# EAGLE design RocketometerPx 9DS0 (EAGLE 6.2)
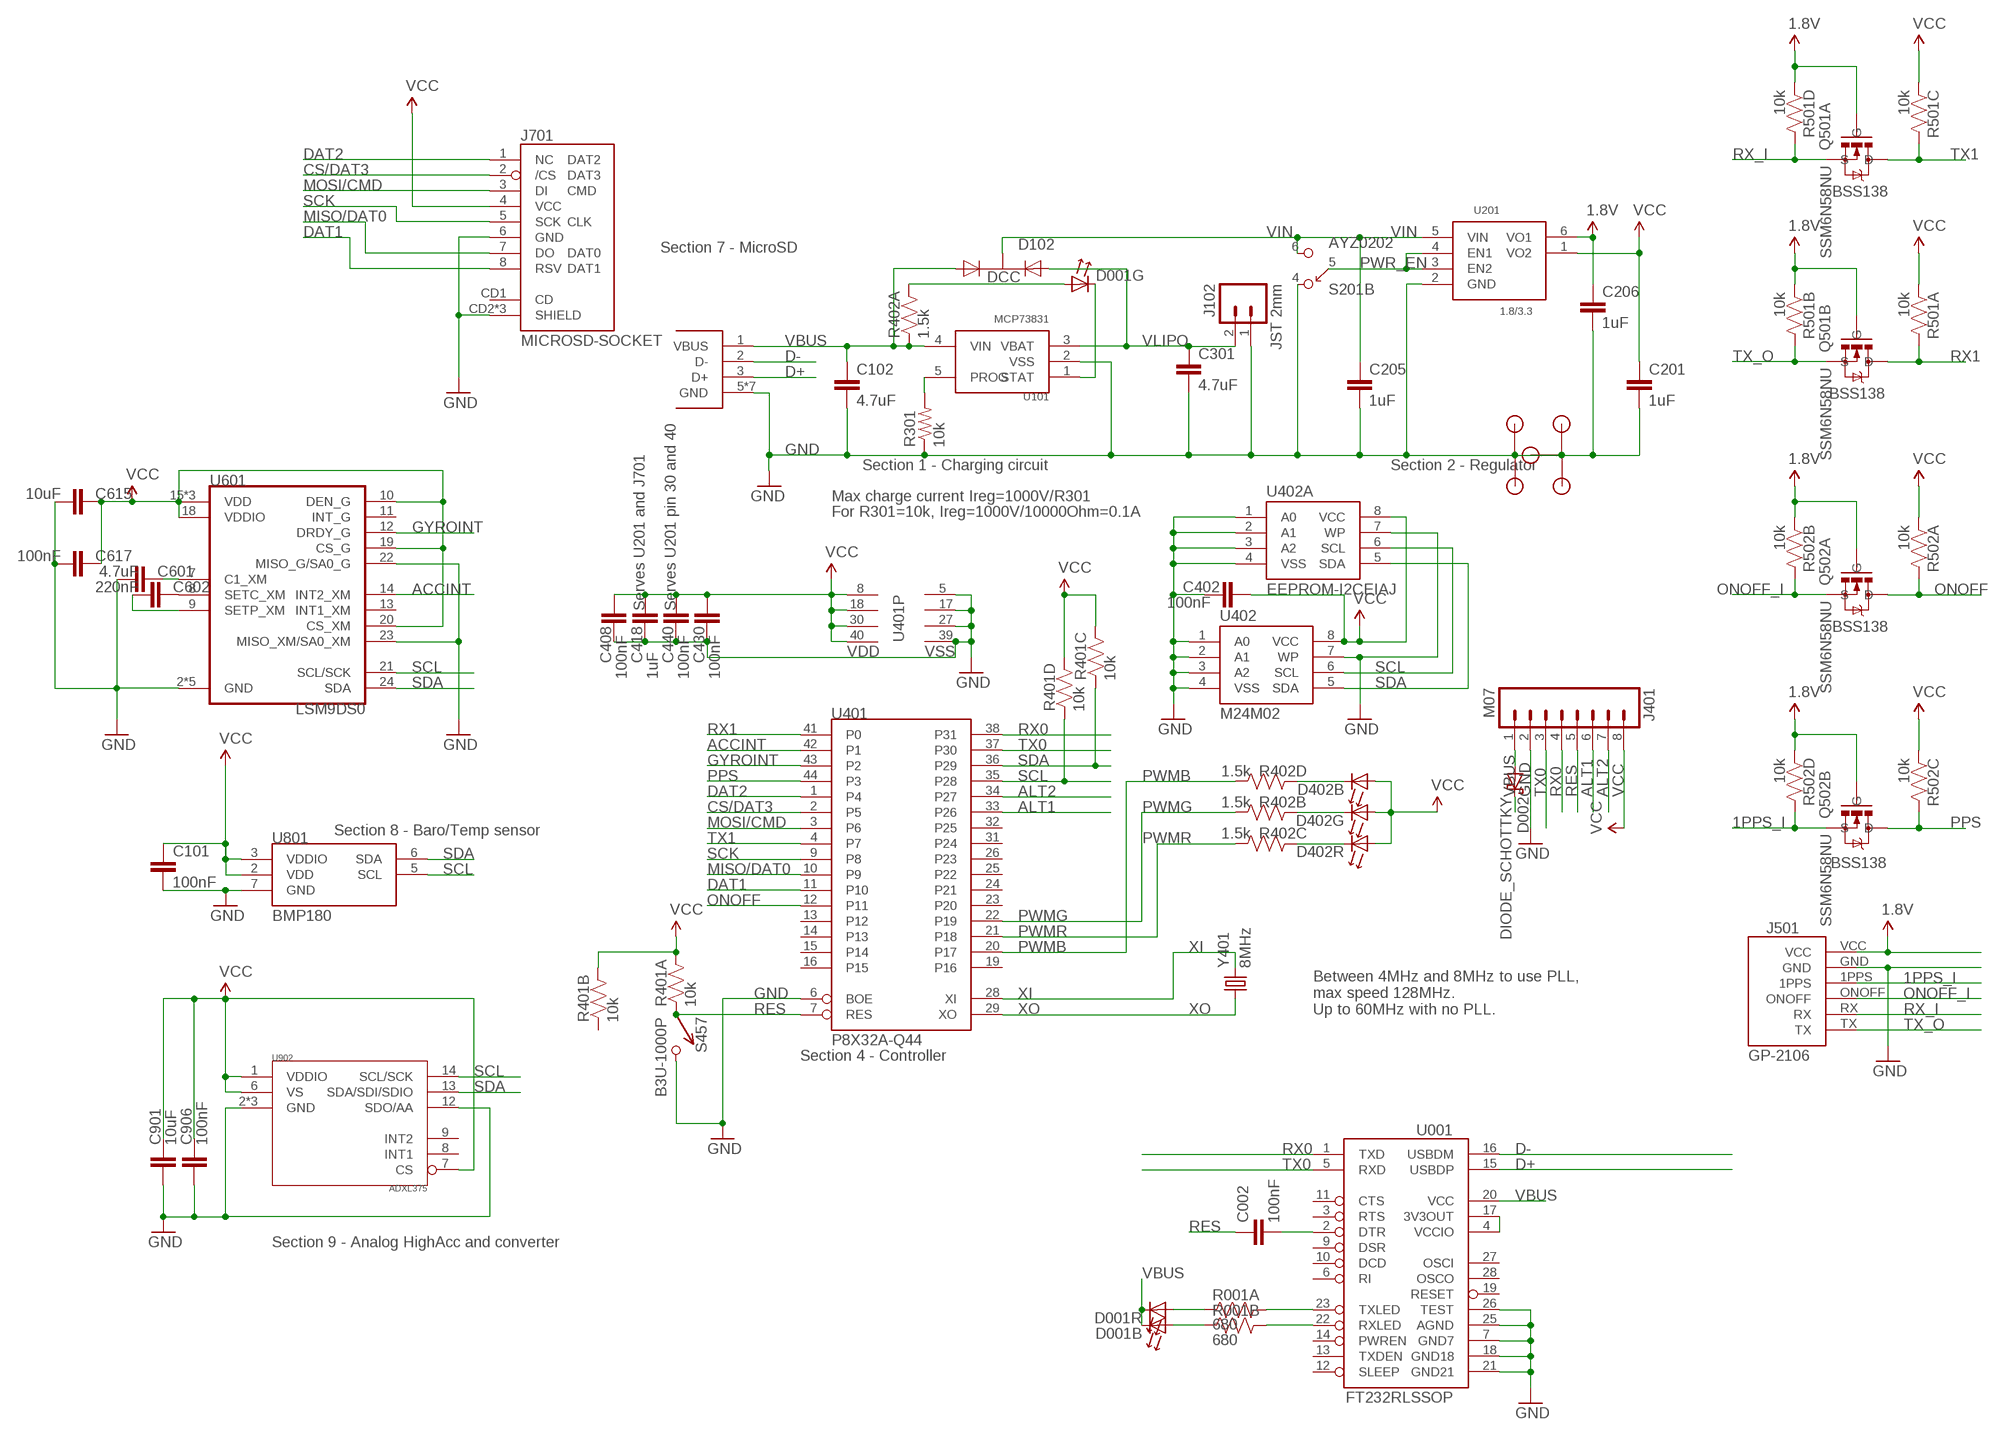
[diagram p0: schematic, sheet 1]

## Parts
C002  100nF  CAP0402-CAP  [0402-CAP]
C101  100nF  CAP0402-CAP  [0402-CAP]
C102  4.7uF  CAP0402-CAP  [0402-CAP]
C201  1uF  CAP0402-CAP  [0402-CAP]
C205  1uF  CAP0402-CAP  [0402-CAP]
C206  1uF  CAP0402-CAP  [0402-CAP]
C301  4.7uF  CAP0402-CAP  [0402-CAP]
C402  100nF  CAP0402-CAP  [0402-CAP]
C408  100nF  CAP0402-CAP  [0402-CAP]
C418  1uF  CAP0402-CAP  [0402-CAP]
C430  100nF  CAP0402-CAP  [0402-CAP]
C440  100nF  CAP0402-CAP  [0402-CAP]
C601  4.7uF  CAP0402-CAP  [0402-CAP]
C602  220nF  CAP0402-CAP  [0402-CAP]
C615  10uF  CAP0603-CAP  [0603-CAP]
C617  100nF  CAP0402-CAP  [0402-CAP]
C901  10uF  CAP0603-CAP  [0603-CAP]
C906  100nF  CAP0402-CAP  [0402-CAP]
D001  SMLP36RGB2W(R)  [SMLP36]
D002  DIODE_SCHOTTKY  [D0603]
D102  DCC  PMEG2005CT  [SOT-23-3]
D402  SMLP36RGB2W(R)  [SMLP36]
J001  USB_MICROB_JSTFCI  [USB-MICROB-CONN-09505]
J102  JST 2mm  M02-JST-2MM-SMT  [JST-2-SMD]
J401  M07  M08NOSILK  [M08SIP]
J501  GP-2106  [GP-2106]
J701  MICROSD-SOCKET  [MICROSD-SOCKET-PP]
JP1  STANDOFF  [STANDOFF]
JP2  STANDOFF  [STANDOFF]
JP3  STANDOFF  [STANDOFF]
JP4  STANDOFF  [STANDOFF]
JP5  STANDOFF  [STANDOFF]
Q501  SSM6N58NU  [UDFN6]
Q502  SSM6N58NU  [UDFN6]
R001  680  RP2EXB24V  [CRA02]
R301  10k  RESISTOR0402-RES  [0402-RES]
R401  10k  RP404  [CRA04]
R402  1.5k  RP404  [CRA04]
R501  10k  RP404  [CRA04]
R502  10k  RP404  [CRA04]
S201  AYZ0202  [AYZ0202]
S457  B3U-1000P  [B3U-1000P]
U001  FT232RLSSOP  [SSOP28DB]
U101  MCP73831  [SOT-23-5]
U201  1.8/3.3  AP73X2  [SOT-23-6]
U401  P8X32A-Q44  [P8X32A-Q44]
U402  M24M02  EEPROM-I2C  [SO8N]
U402A  EEPROM-I2CEIAJ  [SO08-EIAJ]
U601  LSM9DS0  [LGA24_LSM]
U801  BMP180  [BMP180]
U902  ADXL375  [ADXL375]
Y401  8MHz  NX3225GD  [CRYSTAL_SMD_3_2MM_2_5MM]

## Nets
1.8V: C206.1 J501.VCC Q501.2(A:G) Q501.5(B:G) Q502.2(A:G) Q502.5(B:G) R501.2 R501.4 R502.2 R502.4 U201.6(VO1)
1PPS_I: J501.1PPS Q502.4(B:S) R502.5
ACCINT: U401.42(P1) U601.14(INT2_XM)
ALT1: J401.6 U401.33(P26)
ALT2: J401.7 U401.34(P27)
CS/DAT3: J701.2(/CS) U401.2(P5)
D+: J001.3(D+) U001.15(USBDP)
D-: J001.2(D-) U001.16(USBDM)
DAT1: J701.8(RSV) U401.11(P10)
DAT2: J701.1(NC) U401.1(P4)
DTR#: C002.2 U001.2(DTR)
GND [power]: C101.2 C102.2 C201.2 C205.2 C206.2 C301.2 C402.2 C408.2 C418.2 C430.2 C440.2 C601.2 C615.1 C617.1 C901.2 C906.2 J001.5(GND) J001.P1(GND) J001.P2(GND) J001.P3(GND) J001.P4(GND) J001.P5(GND) J001.P6(GND) J102.1 J401.2 J501.GND J701.6(GND) J701.CD2(SHIELD) J701.GND1(SHIELD) J701.GND3(SHIELD) JP1.P$1 JP2.P$1 JP3.P$1 JP4.P$1 JP5.P$1 R301.1 S201.4 S457.P$2 U001.7(GND7) U001.18(GND18) U001.21(GND21) U001.25(AGND) U001.26(TEST) U101.2(VSS) U201.2(GND) U401.5(VSS) U401.6(BOE) U401.17(VSS) U401.27(VSS) U401.39(VSS) U402.1(A0) U402.2(A1) U402.3(A2) U402.4(VSS) U402.7(WP) U402A.1(A0) U402A.2(A1) U402A.3(A2) U402A.4(VSS) U402A.7(WP) U601.2(GND) U601.3(GND) U601.4(GND) U601.5(GND) U601.6(GND) U601.22(MISO_G/SA0_G) U601.23(MISO_XM/SA0_XM) U801.7(GND) U902.2(GND) U902.4(GND) U902.5(GND) U902.12(SDO/AA)
GYROINT: U401.43(P2) U601.12(DRDY_G)
MISO/DAT0: J701.7(DO) U401.10(P9)
MOSI/CMD: J701.3(DI) U401.3(P6)
N$1: U001.4(VCCIO) U001.17(3V3OUT)
N$2: R301.2 U101.5(PROG)
N$3: C601.1 U601.7(C1_XM)
N$4: D001.5(G:C) U101.1(STAT)
N$5: D001.6(G:A) R402.8
N$6: C602.1 U601.8(SETC_XM)
N$7: C602.2 U601.9(SETP_XM)
N$9: D001.4(R:A) R001.1
N$11: D001.2(B:A) R001.2
ONOFF: Q502.6(A:D) R502.8 U401.12(P11)
ONOFF_I: J501.ONOFF Q502.1(A:S) R502.7
PPS: Q502.3(B:D) R502.6 U401.44(P3)
PWMB: R402.4 U401.20(P17)
PWMG: R402.2 U401.22(P19)
PWMR: R402.3 U401.21(P18)
PWR_EN: S201.5 U201.3(EN2) U201.4(EN1)
QWMB: D402.3(R:C) R402.6
QWMG: D402.5(G:C) R402.7
QWMR: D402.1(B:C) R402.5
RES: C002.1 J401.5 R401.1 S457.P$1 U401.7(RES)
RX0: J401.4 U001.1(TXD) U401.38(P31)
RX1: Q501.3(B:D) R501.8 U401.41(P0)
RX_I: J501.RX Q501.1(A:S) R501.5
RXLED1: R001.3 U001.22(RXLED)
SCK: J701.5(SCK) U401.9(P8)
SCL: R401.4 U401.35(P28) U402.6(SCL) U402A.6(SCL) U601.21(SCL/SCK) U801.5(SCL) U902.14(SCL/SCK)
SDA: R401.3 U401.36(P29) U402.5(SDA) U402A.5(SDA) U601.24(SDA) U801.6(SDA) U902.13(SDA/SDI/SDIO)
TX0: J401.3 U001.5(RXD) U401.37(P30)
TX1: Q501.6(A:D) R501.6 U401.4(P7)
TX_O: J501.TX Q501.4(B:S) R501.7
TXLED1: R001.4 U001.23(TXLED)
VBUS: C102.1 D001.1(B:C) D001.3(R:C) D002.C(K) D102.1(A1) J001.1(VBUS) R402.1 U001.20(VCC) U101.4(VIN)
VBUS+: D002.A J401.1
VCC [power]: C101.1 C201.1 C402.1 C408.1 C418.1 C430.1 C440.1 C615.2 C617.2 C901.1 C906.1 D402.2(B:A) D402.4(R:A) D402.6(G:A) J401.8 J701.4(VCC) R401.5 R401.6 R401.7 R401.8 R501.1 R501.3 R502.1 R502.3 U201.1(VO2) U401.8(VDD) U401.18(VDD) U401.30(VDD) U401.40(VDD) U402.8(VCC) U402A.8(VCC) U601.10(DEN_G) U601.15(VDD) U601.16(VDD) U601.17(VDD) U601.18(VDDIO) U601.19(CS_G) U601.20(CS_XM) U801.2(VDD) U801.3(VDDIO) U902.1(VDDIO) U902.6(VS) U902.7(CS)
VIN: C205.1 D102.3(K) S201.6 U201.5(VIN)
VLIPO: C301.1 D102.2(A2) J102.2 U101.3(VBAT)
XI: U401.28(XI) Y401.2
XO: U401.29(XO) Y401.1
Unconnected: J701.CD1(CD) R401.2 S201.1 S201.2 S201.3 U001.3(RTS) U001.6(RI) U001.9(DSR) U001.10(DCD) U001.11(CTS) U001.12(SLEEP) U001.13(TXDEN) U001.14(PWREN) U001.19(RESET) U001.27(OSCI) U001.28(OSCO) U401.13(P12) U401.14(P13) U401.15(P14) U401.16(P15) U401.19(P16) U401.23(P20) U401.24(P21) U401.25(P22) U401.26(P23) U401.31(P24) U401.32(P25) U601.11(INT_G) U601.13(INT1_XM) U902.8(INT1) U902.9(INT2)

## Notes on the sheet
- BSS138
- Section 7 - MicroSD
- BSS138
- Section 1 - Charging circuit | Section 2 - Regulator
- Max charge current Ireg=1000V/R301
- For R301=10k, Ireg=1000V/10000Ohm=0.1A
- Serves U201 and J701 | Serves U201 pin 30 and 40
- BSS138
- Section 8 - Baro/Temp sensor
- BSS138
- Between 4MHz and 8MHz to use PLL,
  max speed 128MHz. 
  Up to 60MHz with no PLL.
- Section 4 - Controller
- Section 9 - Analog HighAcc and converter

## Library data of the parts
C002 = SparkFun:CAP: Capacitor Standard 0603 ceramic capacitor, and 0.1" leaded capacitor.; DIGIKEY: 445-1268-1-ND
C101 C206 C402 C408 C430 C440 C602 C617 = SparkFun:CAP: Capacitor Standard 0603 ceramic capacitor, and 0.1" leaded capacitor.; DIGIKEY: 445-1265-1-ND; NEWARK: 90R7596
C102 C201 C301 C601 = SparkFun:CAP: Capacitor Standard 0603 ceramic capacitor, and 0.1" leaded capacitor.; DIGIKEY: 445-7395-1-ND; NEWARK: 48T2906
C205 C418 = SparkFun:CAP: Capacitor Standard 0603 ceramic capacitor, and 0.1" leaded capacitor.; DIGIKEY: 445-4114-1-ND; NEWARK: 90R7580
C615 C901 = SparkFun:CAP: Capacitor Standard 0603 ceramic capacitor, and 0.1" leaded capacitor.; DIGIKEY: 445-7486-1-ND
C906 = SparkFun-Passives:CAP: Capacitor Standard 0603 ceramic capacitor, and 0.1" leaded capacitor.; DIGIKEY: 445-1317-2-ND
D001 D402 = KwanSystems:SMLP36RGB2W(R)
D002 = KwanSystems:DIODE_SCHOTTKY
D102 = KwanSystems:PMEG2005CT; DIGIKEY: 568-6500-1-ND
J001 = KwanSystems:USB_MICROB_JST; DIGIKEY: 455-2562-1-ND
J102 = SparkFun:M02: Header 2 Standard 2-pin 0.1" header. Use with straight break away headers (SKU : PRT-00116), right angle break away headers (PRT-00553), swiss pins (PRT-00743), machine pins (PRT-00117), and female headers (PRT-00115). Molex polarized connector foot print use with SKU : PRT-08233 with associated crimp pins and housings.; DIGIKEY: 455-1749-1-ND
J401 = KwanSystems:M08; DIGIKEY: $NOPART
J501 = SparkFun:GP-2106: GP-2106 GPS SiRF IV
J701 = KwanSystems:MICROSD-SOCKET: microSD Socket Push-push type uSD socket. Digikey 101-00660-68-6-1-ND. tDoc lines correctly indicate media card edge positions when inserting (unlocked, locked, depressed).; DIGIKEY: 101-00581-59-1-ND
JP1 JP2 = KwanSystems:STANDOFF; DIGIKEY: $NOPART
JP3-JP5 = KwanSystems:STANDOFF; DIGIKEY: $NOPART; NEWARK: $NOPART
Q501 Q502 = KwanSystems:SSM6N58NU
R001 = KwanSystems:RP2; DIGIKEY: CRA4S8680CT-ND
R301 = SparkFun:RESISTOR: Resistor Basic schematic elements and footprints for 0603, 1206, and PTH resistors.; DIGIKEY: P10.0KLCT-ND
R401 R501 R502 = KwanSystems:RP4; DIGIKEY: CRA4S810KCT-ND
R402 = KwanSystems:RP4; DIGIKEY: CRA4S81.5KCT-ND
S201 = KwanSystems:AYZ0202; DIGIKEY: 401-2013-1-ND
S457 = KwanSystems:B3U-1000P; DIGIKEY: SW1020CT-ND
U001 = SparkFun-DigitalIC:FT232RL: USB UART FT232RL 4th Generation USB UART (USB <-> Serial) Controller. Spark Fun Electronics SKU : COM-00650; DIGIKEY: 768-1007-1-ND
U101 = KwanSystems:MCP73831; DIGIKEY: 576-1910-1-ND
U201 = KwanSystems:AP73X2: Dual 300mA LDO Regulator http://www.diodes.com/datasheets/AP7332.pdf
U401 = KwanSystems:P8X32A-Q44: Propellor uC; DIGIKEY: P8X32A-Q44-ND
U402 = KwanSystems:EEPROM-I2C; DIGIKEY: 497-11600-1-ND
U402A = KwanSystems:EEPROM-I2C; DIGIKEY: $NOPART
U601 = KwanSystems:LSM9DS0
U801 = KwanSystems:BMP180; DIGIKEY: 828-1027-1-ND
U902 = KwanSystems:ADXL375
Y401 = KwanSystems:NX3225GD; DIGIKEY: 644-1178-1-ND

## Net classes
0 default: width 0.152 mm, drill 0.33 mm, clearance 0.152 mm
1 power: width 0.152 mm, drill 0.33 mm, clearance 0.152 mm to class 0, clearance 0.152 mm
2 hv: width 0.152 mm, drill 0.33 mm, clearance 0.152 mm to class 0, clearance 0.152 mm to class 1, clearance 0.152 mm

## Board
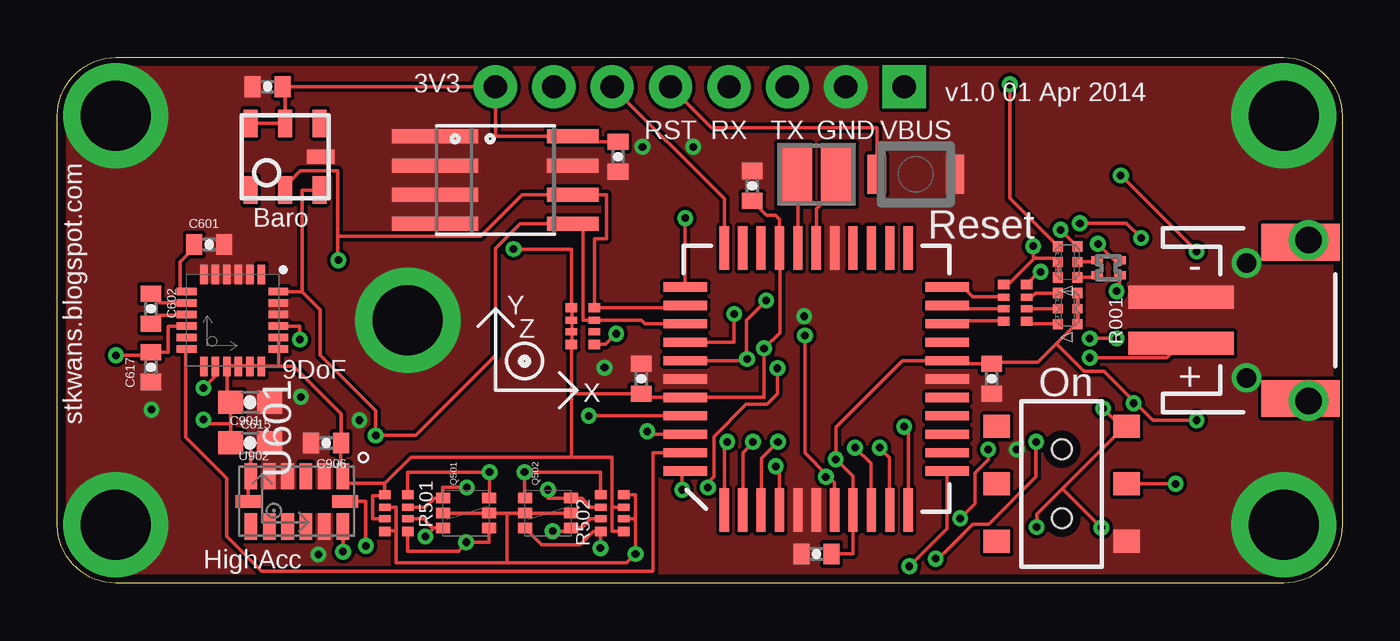
[diagram p1: board, top side]
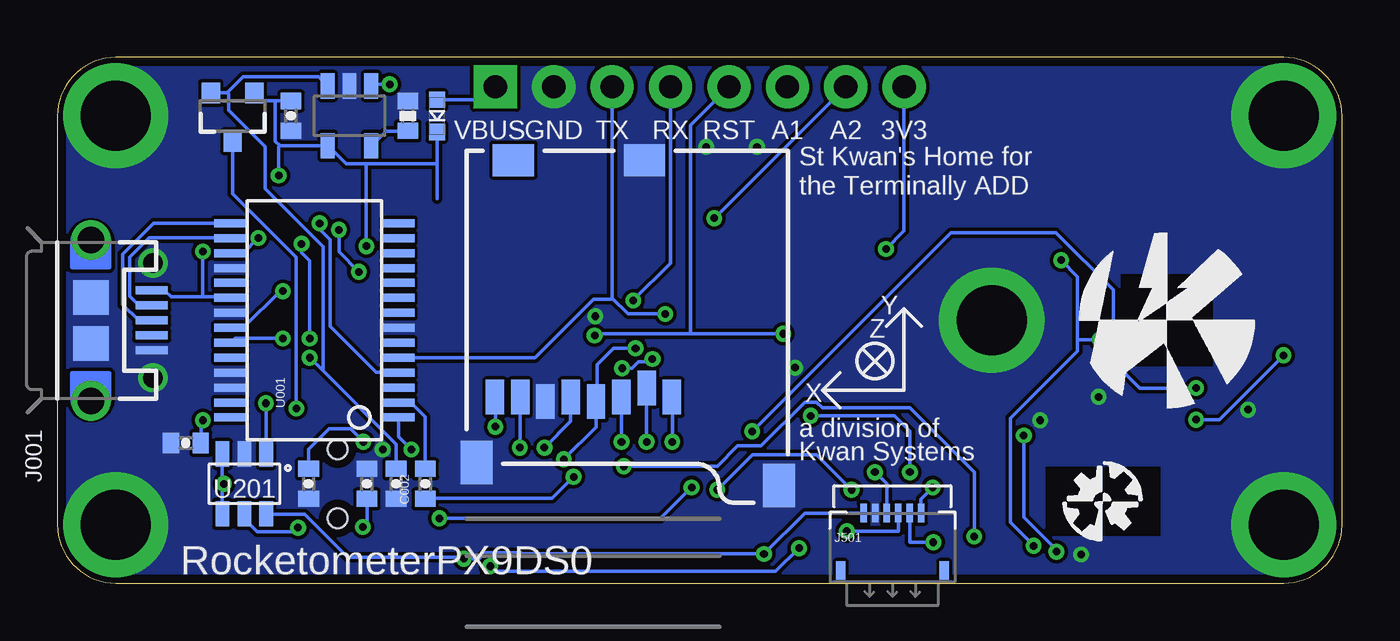
[diagram p2: board, bottom side, seen from below]

Size 55.88 x 22.86 mm. Coordinates in mm from the lower left corner, seen from the top.
Outline: 2.54,22.86 53.34,22.86 arc-90 55.88,20.32 55.88,2.54 arc-90 53.34,0 2.54,0 arc-90 0,2.54 0,20.32 arc-90 2.54,22.86
Copper layers (1*16): Top 0.0356mm / dielectric 1.5011mm / Bottom 0.0356mm
Design rules: minimum track width 6mil, minimum drill 13mil, track to track 6mil, track to pad 6mil, pad to pad 6mil, via to via 6mil, smd to smd 6mil, copper to edge 15mil, drill to drill 6mil, minimum pad ring 7mil, minimum via ring 7mil, stop-mask expansion 4mil, vias tented up to drill 14mil, thermal gap 10mil

### Footprints (pad centres in the part's own frame; a part is rotated, then mirrored left to right if it is on the bottom)
0402-CAP = smd 0.7 x 0.9: 1 -0.65,0; 2 0.65,0
0603-CAP = smd 1.1 x 1: 1 -0.85,0; 2 0.85,0
SMLP36 = smd 0.45 x 0.45: 1 -0.675,0.425; 2 -0.675,-0.425; 5 0.675,0.425; 6 0.675,-0.425 | smd 0.4 x 0.45: 3 0,0.425; 4 0,-0.425
D0603 = smd 0.7 x 0.7: A -0.7,0; C 0.7,0
SOT-23-3 = smd 0.9 x 0.8: 1 -1,0.95; 2 -1,-0.95; 3 1.1,0
USB-MICROB-CONN-09505 = smd 0.35 x 1.4: 1 -1.3,4.1; 2 -0.65,4.1; 3 0,4.1; 4 0.65,4.1; 5 1.3,4.1 | smd 1.5 x 1.55: P1 -1,1.45; P2 1,1.45 | drill 1.15 pad 1.422: P3 -3.5,1.45; P4 3.5,1.45 | drill 0.85 pad 1.27: P5 -2.5,4.15; P6 2.5,4.15
JST-2-SMD = smd 1 x 4.6: 1 -1,-3.7; 2 1,-3.7 | smd 1.6 x 3.4: NC1 -3.4,1.5; NC2 3.4,1.5
M08SIP = drill 1.016 pad 1.88 square: 1 0,0 | drill 1.016 pad 1.88: 2 2.54,0; 3 5.08,0; 4 7.62,0; 5 10.16,0; 6 12.7,0; 7 15.24,0; 8 17.78,0
GP-2106 = smd 0.3 x 0.8: 1PPS -0.25,0; GND -0.75,0; ONOFF 0.25,0; RX 0.75,0; TX 1.25,0; VCC -1.25,0 | smd 0.4 x 0.8: P$7 -2.25,-2.5; P$8 2.25,-2.5
MICROSD-SOCKET-PP = smd 0.8 x 1.5: 1 -8.94,10.7; 2 -7.84,10.3; 3 -6.74,10.7; 4 -5.64,10.9; 5 -4.54,10.7; 6 -3.44,10.9; 7 -2.34,10.7; 8 -1.24,10.7 | smd 1.8 x 1.4: CD1 -2.05,0.4; CD2 -7.75,0.4 | smd 1.4 x 1.9: GND1 -13.6,14.55; GND3 -0.45,13.55
STANDOFF = drill 3.048 pad 4.572: P$1 0,0
UDFN6 = smd 0.45 x 0.6: 1 -0.65,-1; 2 0,-1; 3 0.65,-1; 4 0.65,1; 5 0,1; 6 -0.65,1
CRA02 = smd 0.35 x 0.5: 1 -0.325,-0.5; 2 0.325,-0.5; 3 0.325,0.5; 4 -0.325,0.5
0402-RES = smd 0.7 x 0.9: 1 -0.65,0; 2 0.65,0
CRA04 = smd 0.4 x 0.5: 1 -0.8,-0.5; 4 0.8,-0.5; 5 0.8,0.5; 8 -0.8,0.5 | smd 0.3 x 0.5: 2 -0.25,-0.5; 3 0.25,-0.5; 6 0.25,0.5; 7 -0.25,0.5
AYZ0202 = smd 1 x 1.15: 1 -2.5,2.825; 2 0,2.825; 3 2.5,2.825; 4 -2.5,-2.825; 5 0,-2.825; 6 2.5,-2.825 | hole 0.85: 1.5,0; -1.5,0
B3U-1000P = smd 0.8 x 1.7: P$1 -1.7,0; P$2 1.7,0
SSOP28DB = smd 0.348 x 1.397: 1 -4.225,-3.656; 2 -3.575,-3.656; 3 -2.925,-3.656; 4 -2.275,-3.656; 5 -1.625,-3.656; 6 -0.975,-3.656; 7 -0.325,-3.656; 8 0.325,-3.656; 9 0.975,-3.656; 10 1.625,-3.656; 11 2.275,-3.656; 12 2.925,-3.656; 13 3.575,-3.656; 14 4.225,-3.656; 15 4.225,3.656; 16 3.575,3.656; 17 2.925,3.656; 18 2.275,3.656; 19 1.625,3.656; 20 0.975,3.656; 21 0.325,3.656; 22 -0.325,3.656; 23 -0.975,3.656; 24 -1.625,3.656; 25 -2.275,3.656; 26 -2.925,3.656; 27 -3.575,3.656; 28 -4.225,3.656
SOT-23-5 = smd 0.6 x 1.1: 1 -0.95,-1.3; 2 0,-1.3; 3 0.95,-1.3; 4 0.95,1.3; 5 -0.95,1.3
SOT-23-6 = smd 0.6 x 1.1: 1 -0.95,-1.3; 2 0,-1.3; 3 0.95,-1.3; 4 0.95,1.3; 5 0,1.3; 6 -0.95,1.3
P8X32A-Q44 = smd 1.9 x 0.4: 1 -5.713,4.013; 2 -5.713,3.212; 3 -5.713,2.413; 4 -5.713,1.613; 5 -5.713,0.812; 6 -5.713,0.013; 7 -5.713,-0.787; 8 -5.713,-1.587; 9 -5.713,-2.388; 10 -5.713,-3.188; 11 -5.713,-3.987; 23 5.688,-3.987; 24 5.688,-3.188; 25 5.688,-2.388; 26 5.688,-1.587; 27 5.688,-0.787; 28 5.688,0.013; 29 5.688,0.812; 30 5.688,1.613; 31 5.688,2.413; 32 5.688,3.212; 33 5.688,4.013 | smd 0.4 x 1.9: 12 -4.013,-5.688; 13 -3.212,-5.688; 14 -2.413,-5.688; 15 -1.613,-5.688; 16 -0.812,-5.688; 17 -0.013,-5.688; 18 0.787,-5.688; 19 1.587,-5.688; 20 2.388,-5.688; 21 3.188,-5.688; 22 3.987,-5.688; 34 3.987,5.713; 35 3.188,5.713; 36 2.388,5.713; 37 1.587,5.713; 38 0.787,5.713; 39 -0.013,5.713; 40 -0.812,5.713; 41 -1.613,5.713; 42 -2.413,5.713; 43 -3.212,5.713; 44 -4.013,5.713
SO8N = smd 0.61 x 2.21: 1 -1.905,-2.616; 2 -0.635,-2.616; 3 0.635,-2.616; 4 1.905,-2.616; 5 1.905,2.616; 6 0.635,2.616; 7 -0.635,2.616; 8 -1.905,2.616
SO08-EIAJ = smd 0.61 x 2.21: 1 -1.905,-3.378; 2 -0.635,-3.378; 3 0.635,-3.378; 4 1.905,-3.378; 5 1.905,3.353; 6 0.635,3.353; 7 -0.635,3.353; 8 -1.905,3.353
LGA24_LSM = smd 0.85 x 0.34: 1 -2,1.25; 2 -2,0.75; 3 -2,0.25; 4 -2,-0.25; 5 -2,-0.75; 6 -2,-1.25; 13 2,-1.25; 14 2,-0.75; 15 2,-0.25; 16 2,0.25; 17 2,0.75; 18 2,1.25 | smd 0.34 x 0.85: 7 -1.25,-2; 8 -0.75,-2; 9 -0.25,-2; 10 0.25,-2; 11 0.75,-2; 12 1.25,-2; 19 1.25,2; 20 0.75,2; 21 0.25,2; 22 -0.25,2; 23 -0.75,2; 24 -1.25,2
BMP180 = smd 0.6 x 1.2: 1 1.5,1.45; 2 0,1.45; 3 -1.5,1.45; 4 -1.5,-1.45; 5 0,-1.45; 6 1.5,-1.45 | smd 1.2 x 0.6: 7 1.55,0
ADXL375 = smd 0.55 x 1.145: 1 2,1.097; 2 1.2,1.097; 3 0.4,1.097; 4 -0.4,1.097; 5 -1.2,1.097; 6 -2,1.097; 8 -2,-1.097; 9 -1.2,-1.097; 10 -0.4,-1.097; 11 0.4,-1.097; 12 1.2,-1.097; 13 2,-1.097 | smd 1.145 x 0.55: 7 -2.098,0; 14 2.098,0
CRYSTAL_SMD_3_2MM_2_5MM = smd 1.5 x 2.7: 1 -0.95,0; 2 0.95,0

### Placement (x,y rotation side)
C002  39.88,4.32 90 bottom
C101  9.14,21.59 180 top
C102  45.72,20.32 270 bottom
C201  50.29,6.1 180 bottom
C205  42.42,4.32 90 bottom
C206  44.96,4.32 270 bottom
C301  41.15,4.32 270 bottom
C402  24.38,18.54 270 top
C408  33.02,1.27 180 top
C418  40.64,8.89 270 top
C430  30.23,17.27 90 top
C440  25.4,8.89 90 top
C601  6.6,14.73 0 top
C602  4.06,11.94 270 top
C615  8.38,7.87 180 top
C617  4.06,9.4 90 top
C901  8.38,6.1 0 top
C906  11.68,6.1 180 top
D001  43.94,13.97 90 top
D002  39.37,20.32 270 bottom
D102  48.26,20.32 270 bottom
D402  43.94,11.94 90 top
J001  55.88,11.43 270 bottom
J102  52.58,11.43 270 top
J401  36.83,21.59 180 top
J501  19.56,3.05 0 bottom
J701  38.09,18.8 180 bottom
JP1  2.54,2.54 0 top
JP2  2.54,20.32 0 top
JP3  15.24,11.43 0 top
JP4  53.34,2.54 0 top
JP5  53.34,20.32 0 top
Q501  17.78,3.05 90 top
Q502  21.34,3.05 90 top
R001  45.72,13.72 270 top
R301  40.64,20.32 270 bottom
R401  22.86,11.18 90 top
R402  41.66,12.19 270 top
R501  14.73,3.05 270 top
R502  24.13,3.05 90 top
S201  43.69,4.32 90 top
S457  37.34,17.78 0 top
U001  44.7,11.43 90 bottom
U101  43.18,20.32 180 bottom
U201  47.75,4.32 180 bottom
U401  33.02,8.89 90 top
U402  19.81,17.53 270 top
U402A  19.05,17.53 270 top
U601  7.62,11.43 270 top
U801  9.91,18.54 0 top
U902  10.41,3.56 0 top
U$4  [AXES]  19.05,8.38 0 top
U$5  [KWAN_ACC]  7.62,11.43 0 bottom
U$6  [OSHW_ACC]  10.41,3.56 0 bottom
Y401  33.02,17.78 0 top

### Tracks (layer width: path | path; a pad name or v marks a point on that pad's centre or on a via)
1.8V  (via drill 0.33)
  Top 0.152: Q501.5 Q501.2 19.56,3.05 | 19.56,3.05 Q502.5 Q502.2 | R501.2 14.73,3.3 14.73,2.29 | 14.73,2.29 14.73,0.89 19.56,0.89 | R501.4 14.49,2.29 14.73,2.29 | 19.56,0.89 19.56,3.05 | R502.2 25.15,2.8 | 25.15,2.8 v25.15,1.27 24.77,0.89 19.56,0.89 | R502.4 25.15,3.85 25.15,2.8 | v42.57,6.15 42.57,4.62 40.51,2.56 39.83,2.56 38.33,1.07 v38.2,1.07
  Bottom 0.152: J501.VCC 23.37,3.05 v25.15,1.27 35.66,1.27 35.71,1.32 37.29,1.32 37.54,1.07 v38.2,1.07 38.25,1.12 43.26,1.12 45.14,3 46.79,3 U201.6 | C206.1 44.96,5.82 44.07,6.71 43.13,6.71 v42.57,6.15
1PPS_I  (via drill 0.33)
  Top 0.152: 23.62,3.86 R502.5 23.63,4.82 23.62,4.83 v20.32,4.83 20.32,3.7 Q502.4
  Bottom 0.152: J501.1PPS 19.81,4.31 v20.32,4.83
ACCINT  (via drill 0.33)
  Top 0.152: v6.35,8.48 6.86,8.99 6.86,9.42 U601.14 | U401.42 25.78,6.48 v25.65,6.6
  Bottom 0.152: v6.35,8.48 8.79,8.48 9.96,9.65 9.96,12.75 12.45,15.24 17.02,15.24 v25.65,6.6
ALT1
  Top 0.152: J401.6 29.01,16.71 U401.33
ALT2  (via drill 0.33)
  Top 0.152: v27.3,15.88 U401.34
  Bottom 0.152: J401.7 v27.3,15.88
CS/DAT3  (via drill 0.33)
  Top 0.152: v30.25,6.15 30.25,6.1 29.82,5.66 29.82,3.2 U401.2
  Bottom 0.152: v30.25,6.15 30.25,8.48 J701.2
D+
  Bottom 0.152: J001.3 52.35,11.43 53.03,12.12 53.03,14.3 51.69,15.65 U001.15
D-
  Bottom 0.152: U001.16 51.89,15.01 52.73,14.17 52.73,12.47 52.35,12.09 J001.2
DAT1  (via drill 0.33)
  Top 0.152: U401.11 37.01,6.68 v36.83,6.81
  Bottom 0.152: v36.83,6.81 36.83,8.08 J701.8
DAT2  (via drill 0.33)
  Top 0.152: U401.1 29.01,6.02 v29.13,6.15
  Bottom 0.152: v29.13,6.15 29.13,8.08 J701.1
DTR#
  Bottom 0.152: C002.2 39.88,7.24 40.49,7.85 U001.2
GND  (via drill 0.33)
  other vias: 27.66,18.97 23.8,9.37 11.35,1.24 10.59,8.1 25.45,18.97 32.49,11.61 13.13,7.09 4.09,7.54 41.73,5.82
  pour Top (no thermals): 2.54,22.86 53.34,22.86 55.88,22.86 55.88,2.54 arc-90 53.34,0 2.54,0 arc-90 0,2.54 0,20.32 arc-90
  pour Bottom (no thermals): 2.54,22.86 53.34,22.86 55.88,22.86 55.88,2.54 arc-90 53.34,0 2.54,0 arc-90 0,2.54 0,20.32 arc-90
GYROINT
  Top 0.152: U601.12 5.61,10.16 5.61,10.08 5.59,10.01 5.59,6.35 7.37,4.57 7.37,2.03 8.89,0.51 25.88,0.51 25.91,0.53 25.91,5.68 U401.43 27.3,5.66
MISO/DAT0  (via drill 0.33)
  Top 0.152: U401.10 36.2,3.2 36.2,5.46 v35.76,5.89
  Bottom 0.152: v35.76,5.89 35.76,8.08 J701.7
MOSI/CMD  (via drill 0.33)
  Top 0.152: v31.34,6.15 30.63,5.44 30.63,3.2 U401.3
  Bottom 0.152: v31.34,6.15 31.34,8.08 J701.3
N$1  (via drill 0.33)
  Top 0.152: v44.48,15.65 46.51,15.65 v47.14,15.01
  Bottom 0.152: v44.48,15.65 44.48,15.39 44.02,14.94 44.02,11.18 42.01,9.17 41.07,9.17 U001.4 | v47.14,15.01 47.78,14.38 48.34,14.38 U001.17
N$2
  Bottom 0.152: R301.2 41.58,19.66 42.22,19.02 U101.5
N$3
  Top 0.152: 5.61,12.7 U601.7 5.33,12.68 5.33,13.97 5.95,14.59 C601.1
N$4  (via drill 0.33)
  Top 0.152: v41.43,21.69 41.43,16.74 D001.5
  Bottom 0.152: v41.43,21.69 42.16,21.69 42.22,21.64 U101.1
N$5  (via drill 0.33)
  Top 0.152: v43.64,15.37 44.35,14.66 D001.6 | v42.77,13.54 42.7,13.54 42.16,13.01 R402.8
  Bottom 0.152: v43.64,15.37 43.64,14.4 v42.77,13.54
N$6
  Top 0.152: U601.8 5.61,12.19 4.45,12.19 4.06,12.57 C602.1
N$7
  Top 0.152: U601.9 5.61,11.66 4.42,11.66 4.06,11.3 C602.2
N$9
  Top 0.152: D001.4 45.16,13.97 45.21,14.02 R001.1
N$11
  Top 0.152: D001.2 44.37,13.31 45.14,13.31 R001.2
ONOFF  (via drill 0.33)
  Top 0.152: Q502.6 20.34,2.39 21.06,1.68 22.73,1.68 23.29,2.23 23.62,2.23 R502.8 23.63,1.28 v23.62,1.52 | v37.06,0.74 38.68,2.36 38.68,4.88 U401.12
  Bottom 0.152: v23.62,1.52 24.64,0.51 36.83,0.51 v37.06,0.74
ONOFF_I  (via drill 0.33)
  Top 0.152: R502.7 23.19,2.79 22.81,2.41 22.35,2.41 Q502.1 22.28,2.36 22.17,2.26 v21.54,2.26
  Bottom 0.152: v21.54,2.26 19.31,2.26 J501.ONOFF
PPS  (via drill 0.33)
  Top 0.152: R502.6 23.19,3.3 22.81,3.68 22.35,3.68 Q502.3 21.34,3.7 v21.34,4.06 | v27.18,4.06 27.18,4.88 U401.44
  Bottom 0.152: v21.34,4.06 22.86,5.59 25.65,5.59 v27.18,4.06
PWMB
  Top 0.152: 38.81,11.38 U401.20 38.86,11.4 41.15,11.4 R402.4
PWMG
  Top 0.152: U401.22 38.71,12.85 39.42,12.85 39.83,12.45 41.15,12.45 R402.2
PWMR
  Top 0.152: 38.81,11.96 38.71,12.06 U401.21 38.86,11.94 41.15,11.94 R402.3
PWR_EN  (via drill 0.33)
  Top 0.152: v48.64,4.32 S201.5
  Bottom 0.152: 48.72,4.32 48.72,5.61 U201.3 | 48.72,4.32 48.72,3.02 U201.4 | v48.64,4.32 48.72,4.32
QWMB
  Top 0.152: D402.3 R402.6
QWMG
  Top 0.152: D402.5 43.51,12.6 42.55,12.6 42.39,12.45 R402.7
QWMR
  Top 0.152: D402.1 43.51,11.28 42.27,11.28 42.16,11.38 R402.5
RES  (via drill 0.33)
  Top 0.152: v24.31,10.85 23.85,10.39 R401.1 | 35.64,18.54 S457.P$1 35.64,19.81 28.45,19.81 J401.5 | 33.48,4.7 32.51,5.66 v32.51,10.77 | 33.48,4.7 33.81,4.37 33.81,3.2 U401.7 | v33.43,4.62 33.43,4.65 33.48,4.7
  Bottom 0.152: 28.35,10.85 28.35,19.91 J401.5 | v32.51,10.77 32.44,10.85 28.35,10.85 | 28.35,10.85 v24.31,10.85 | v33.43,4.62 34.37,3.68 39.88,3.68 C002.1
RX0  (via drill 0.33)
  Top 0.152: 28.25,9.7 27.33,9.7 U401.38 29.97,9.68 | 29.97,9.68 29.97,11.43 v30.84,12.29 | v39.27,2.82 39.9,3.45 39.9,4.78 40.49,5.36 v40.49,5.82 | v28.3,4.17 28.3,4.37 28.55,4.62 28.55,6.38 29.95,7.77 30.86,7.77 31.32,8.23 v31.32,9.35 | v30,9.75 29.97,9.68
  Bottom 0.152: J401.4 29.21,13.92 v30.84,12.29 | v39.27,2.82 29.64,2.82 v28.3,4.17 | v31.32,9.35 30.89,9.35 30.61,9.63 30.12,9.63 v30,9.75 | v40.49,5.82 41.05,6.38 41.05,7.19 U001.1
RX1  (via drill 0.33)
  Top 0.152: 18.72,3.76 Q501.3 18.8,3.7 v18.8,4.83 15.23,4.83 R501.8 15.24,3.83 | U401.41 v23.11,7.28
  Bottom 0.152: v18.8,4.83 18.8,6.6 19.47,7.28 v23.11,7.28
RX_I  (via drill 0.33)
  Top 0.152: Q501.1 18.77,2.39 18.77,1.78 v17.78,1.78 17.45,1.4 15.24,1.4 R501.5
  Bottom 0.152: 18.8,3.05 J501.RX 18.81,1.78 v17.78,1.78
RXLED1  (via drill 0.33)
  Top 0.152: v46.08,12.7 46.2,12.83 46.2,13.39 R001.3
  Bottom 0.152: v46.08,12.7 46.2,12.7 47.78,11.12 48.34,11.12 U001.22
SCK  (via drill 0.33)
  Top 0.152: U401.9 35.38,3.2 35.38,5.21 v34.7,5.89
  Bottom 0.152: v34.7,5.89 33.55,7.04 33.55,8.08 J701.5
SCL  (via drill 0.33)
  Top 0.152: U402.6 U402A.6 | 22.96,16.84 22.48,16.84 U402A.6 | U601.21 10.54,11.18 v10.54,10.59 | U801.5 | v13.41,1.63 13.41,3.56 U902.14 12.52,3.56 | U402A.6 20.22,16.89 18.41,15.09 12.19,15.09 | U402A.6 23.88,16.89 23.88,14.99 23.37,14.99 R401.4 27.31,11.98 U401.35 | 12.19,15.09 12.19,17.93 10.57,17.93 10.16,17.53 U801.5 | 9.91,17.27 U801.5 | 12.19,15.09 12.19,14.05 v12.22,14.05
  Bottom 0.152: v13.41,1.63 14.43,2.64 14.43,7.16 11.51,10.08 11.51,10.59 | 11.51,10.59 11.51,13.34 v12.22,14.05 | v10.54,10.59 11.51,10.59
SDA  (via drill 0.33)
  Top 0.152: U402A.5 U402.5 22.86,15.62 22.86,11.43 R401.3 | R401.3 | U401.36 25.55,11.28 25.4,11.43 R401.3 | 22.48,15.57 U402A.5 | 9.63,12.7 U601.24 10.64,12.68 | 11.4,17.07 U801.6 10.64,17.09 10.64,12.68 | v12.42,1.37 12.42,2.44 U902.13 | U402A.5 20.12,15.62 19.05,14.55 19.05,9.91 15.57,6.43 v13.84,6.43 | v13.84,6.43 13.84,6.48 | 10.64,12.68 11.43,11.89 11.43,9.91 13.84,7.49 v13.84,6.43
  Bottom 0.152: v12.42,1.37 12.42,1.45 13.84,2.87 v13.84,6.43
TX0  (via drill 0.33)
  Top 0.152: U401.37 29.44,10.48 v29.44,11.71
  Bottom 0.152: v29.44,11.71 31.06,11.71 31.75,12.39 | J401.3 31.75,12.39 | 31.75,12.39 31.8,12.34 32.56,12.34 35.08,9.83 35.13,9.8 U001.5
TX1  (via drill 0.33)
  Top 0.152: 16.38,2.41 16.31,2.41 15.93,2.79 15.49,2.79 R501.6 | Q501.6 16.76,2.41 16.38,2.41 | 16.38,2.41 v16,2.03 | v31.24,5.08 31.41,4.92 U401.4
  Bottom 0.152: v16,2.03 16,4.83 18.8,7.62 22.61,7.62 22.86,7.87 23.37,7.87 25.27,5.97 26.29,5.97 27.18,5.08 v31.24,5.08
TX_O  (via drill 0.33)
  Top 0.152: 15.47,3.3 R501.7 16,3.3 16.4,3.7 Q501.4 | 16.76,3.71 Q501.4 | 16.84,3.73 Q501.4 | v17.8,4.17 16.76,4.17 16.76,3.71 Q501.4
  Bottom 0.152: J501.TX 18.31,3.66 v17.8,4.17
TXLED1  (via drill 0.33)
  Top 0.152: v45.26,14.76 45.97,14.05 46.2,14.05 R001.4 | v46.08,10.64 v44.91,10.64
  Bottom 0.152: v45.26,14.76 45.26,14.38 44.91,14.02 v44.91,10.64 | v46.08,10.64 48.16,10.64 48.34,10.46 U001.23
VBUS  (via drill 0.33)
  Top 0.152: D001.1 43.54,13.31 43.54,13.97 D001.3 43.46,13.99 43.33,14.12 42.49,14.12 | 42.49,14.12 41.38,13.01 41.17,13.01 R402.1 | v42.44,14.66 42.44,14.17 42.49,14.12 | v46.25,17.73 v49.55,14.43
  Bottom 0.152: 39.37,16.71 39.37,18.24 | 39.37,18.24 D002.C | 48.36,12.42 U001.20 48.44,12.45 49.55,12.45 | 49.55,12.45 50.93,12.45 51.21,12.72 51.77,12.72 J001.1 | 46.41,20.98 46.97,20.98 47.3,21.31 D102.1 | 46.41,20.98 C102.1 | 46.2,19.02 44.15,19.02 U101.4 44.07,18.97 43.33,18.24 42.44,18.24 | 46.2,19.02 46.41,19.23 46.41,20.98 | 42.44,18.24 39.37,18.24 | 42.44,18.24 v42.44,14.66 | v49.55,14.43 49.55,12.45 | v46.25,17.73 46.25,18.97 46.2,19.02
VBUS+
  Bottom 0.152: D002.A 36.83,21.02 J401.1
VCC  (via drill 0.33)
  Top 0.152: C402.1 24.38,19.2 22.66,19.2 U402.8 U402A.8 19.05,19.43 J401.8 9.91,21.59 | 8.38,19.99 U801.3 8.46,19.99 U801.2 | 9.96,20.04 U801.2 | 7.39,9.45 7.85,9.45 U601.16 7.92,9.45 8.36,9.45 U601.17 8.43,9.45 8.87,9.45 U601.18 9.62,9.43 | 7.39,9.45 U601.15 | U902.7 8.31,3.56 8.31,4.45 U902.6 8.41,6.1 C901.1 7.53,6.94 | 30.23,16.43 C430.1 30.85,16 31.24,16 31.41,15.84 U401.30 | 31.39,14.58 U401.30 | U902.1 12.39,4.67 12.32,4.75 C906.1 12.33,7.37 10.27,9.43 9.62,9.43 | 12.37,4.88 U902.1 | R401.5 22.38,11.96 22.38,11.48 R401.6 22.38,11.4 22.38,11 R401.7 22.38,10.92 22.38,10.39 R401.8 22.36,8.23 | 24.64,3.28 R502.3 24.13,3.3 | C440.1 | 27.3,8.1 U401.40 | 25.63,8.18 C440.1 | C440.1 25.32,8.23 22.36,8.23 | U401.30 31.42,14.5 31.42,10.9 v30.73,10.21 30.73,8.08 U401.40 | 22.33,12.04 R401.5 | 22.36,8.23 22.36,5.49 | 22.36,5.49 15.38,5.49 14.23,4.34 | U401.40 25.4,8.08 C440.1 | 14.23,4.34 R501.1 14.19,3.81 13.72,3.81 13.72,2.8 R501.3 | 14.23,4.34 12.61,4.34 U902.1 | 9.91,21.59 U801.2 | 22.36,5.49 24.13,5.49 24.13,3.3 | C408.1 34.59,1.27 34.59,3.17 U401.8 34.59,3.25 34.59,4.65 v33.86,5.38 33.86,6.78 36.73,9.65 36.78,9.68 38.63,9.68 U401.18 | v19.84,14.53 22.36,14.53 R401.5 | 9.62,9.43 U601.19 U601.20 | R502.1 24.13,2.25 24.13,3.3 | 38.84,9.55 U401.18 | U601.10 4.83,11.18 4.83,10.05 C617.2 3.92,9.91 v2.54,9.91 | 7.39,9.45 7.39,8.02 C615.2 7.53,6.94 | 9.91,21.59 C101.1 | 7.53,6.94 6.52,6.94 v6.35,7.11 | D402.6 44.37,12.6 44.37,11.99 D402.4 44.37,11.28 D402.2 44.3,11.25 43.46,10.41 | U401.18 38.89,9.55 C418.1 40.69,9.6 42.65,9.6 43.46,10.41 | v49.55,7.09 47.65,7.09 46.86,7.87 | 46.86,7.87 45.52,9.22 44.65,9.22 43.46,10.41
  Top 0.152: v46.81,7.82 46.86,7.87
  Bottom 0.152: v33.86,5.38 32.46,6.78 32.46,7.87 J701.4 32.41,7.95 32.41,9.5 31.7,10.21 v30.73,10.21 | J401.8 19.05,15.32 v19.84,14.53 | v6.35,7.11 5.33,7.11 v2.54,9.91 | v49.55,7.09 49.63,7.01 C201.1 | v46.81,7.82 46.81,5.64 U201.1
VIN  (via drill 0.33)
  Top 0.152: v42.6,2.44 42.6,3 43.71,4.12 | 43.71,4.12 46.41,6.81 46.51,6.81 S201.6 46.3,6.78 v45.49,7.59 | 43.71,4.12 v45.41,2.41
  Bottom 0.152: C205.1 42.42,2.62 v42.6,2.44 | D102.3 48.26,16.94 45.49,14.17 v45.49,7.59 | U201.5 47.75,2.79 47.19,2.23 45.59,2.23 v45.41,2.41
VLIPO  (via drill 0.33)
  Top 0.152: v44.91,9.8 48.26,9.8 48.87,10.41 J102.2
  Bottom 0.152: 48.49,21.34 49.2,21.34 D102.2 | 48.49,21.34 47.8,22.02 44.53,22.02 44.15,21.64 U101.3 | C301.1 41.15,6.04 44.37,9.27 | v44.91,9.8 44.37,9.27 | 48.49,21.34 48.44,21.29 48.44,20.57 46.84,18.97 46.84,17.14 44.32,14.63 44.32,9.32 44.37,9.27
XI
  Top 0.152: U401.28 33.02,16.28 33.96,17.22 Y401.2
XO
  Top 0.152: U401.29 32.21,17.65 Y401.1

### Text on the board
tPlace: 3V3 | v1.0 01 Apr 2014 | RST | RX | TX | GND | VBUS | stkwans.blogspot.com | Baro | Reset | - | + | 9DoF | On | HighAcc
bPlace: 3V3 | A2 | A1 | RST | RX | TX | GND | VBUS | St Kwan's Home for | the Terminally ADD | a division of | Kwan Systems | RocketometerPX9DS0